# Altium schematic sheet ADC.SchDoc
size A4; DocumentNumber: 8; SheetNumber: 8; SheetTotal: 12
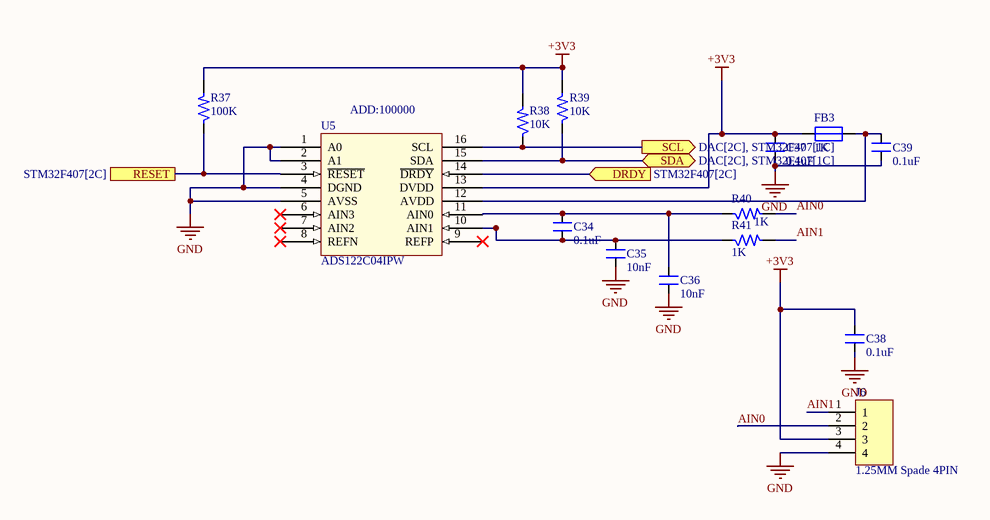
[diagram p0: ADC.SchDoc]

## Parts
C34  0.1uF  [CAP_0805]
C35  10nF  [CAP_0805]
C36  10nF  [CAP_0805]
C37  0.1uF  [CAP_0805]
C38  0.1uF  [CAP_0805]
C39  0.1uF  [CAP_0805]
FB3  1K  [IND_0805]
J6  1.25MM Spade 4PIN  [CON4_50_653004117322_TH_RA]
R37  100K  [RES_0603]
R38  10K  [RES_0603]
R39  10K  [RES_0603]
R40  1K  [RES_0603]
R41  1K  [RES_0603]
U5  ADS122C04IPW  [TSSOP16_25-59_294_54X14_SMT]

## Ports
DRDY (in, see STM32F407[2C]), RESET (see STM32F407[2C]), SCL (out, see DAC[2C], STM32F407[1C]), SDA (bidir, see DAC[2C], STM32F407[1C])

## Nets
+3V3: C37.2 C38.2 FB3.1 J6.3 R37.2 R38.2 R39.2 U5.13(DVDD)
GND: C35.1 C36.1 C37.1 C38.1 C39.1 J6.4 U5.1(A0) U5.2(A1) U5.4(DGND) U5.5(AVSS)
AIN0: J6.2 R40.2
AIN1: J6.1 R41.2
DRDY: U5.14(~{DRDY}) ; port DRDY
RESET: R37.1 U5.3(~{RESET}) ; port RESET
SCL: R38.1 U5.16(SCL) ; port SCL
SDA: R39.1 U5.15(SDA) ; port SDA
NetC34_1: C34.1 C35.2 R41.1 U5.10(AIN1)
NetC34_2: C34.2 C36.2 R40.1 U5.11(AIN0)
NetC39_2: C39.2 FB3.2 U5.12(AVDD)

Not connected (* = marked no-connect by the designer): U5 6(AIN3)* 7(AIN2)* 8(REFN)* 9(REFP)*

## Notes on the sheet
- (near U5) ADD:100000

## Library data of the parts
C34 C37-C39 = CAP_0.1uF-50V-10%-0805: 0.1µF ±10% 50V Ceramic Capacitor X7R 0805 (2012 Metric); Manufacturer: Samsung; Manufacturer Part Number: CL21B104KBCNNNC; Alternate Part Number-1: NA; Case/Package: 0805; Supplier-1: SIRICOM; Supplier Part Number-1: 0805B104K500CT
C35 C36 = CAP_10nF-50V-10%-0805: 10000pF ±10% 50V Ceramic Capacitor X7R 0805 (2012 Metric); Manufacturer: Samsung; Manufacturer Part Number: C0805C103K5RECAUTO; Alternate Part Number-1: GRM2195C1H103JA01D; Case/Package: 0805; Supplier-1: SIRICOM; Supplier Part Number-1: 0805B103K500CT
FB3 = FB_1K-100MHZ-1.6A-0805: 1 kOhms @ 100MHz 1 Power Line Ferrite Bead 0805 (2012 Metric) 1.6A; Manufacturer: Laird; Manufacturer Part Number: BLM21SP102SH1D; Alternate Part Number-1: NA; Case/Package: 0805; Supplier-1: SIRICOM; Supplier Part Number-1: ACMS201209A102
J6 = CON-PLG_4X1-50-RA-TH: 4 Pins, 1 Row 1.25mm Pitch, right angle Connector, male; Manufacturer Part Number: 653004117322; Manufacturer: JST; Mating Part Number: 653004113322; Crimp Part Number: 653153128130; Alternate Part Number-1: NA; Case/Package: TH-CON; Supplier-1: WURTH; Supplier Part Number-1: 653004117322
R37 = RES_100K-0.1W-1%-0603: 100 kOhms ±1% 0.1W, 1/10W Chip Resistor 0603 (1608 Metric) Automotive AEC-Q200 Thick Film; Manufacturer: Stackpole Electronics; Manufacturer Part Number: RMCF0603FT100K; Alternate Part Number-1: NA; Case/Package: 0603; Supplier-1: Arrow; Supplier Part Number-1: RMCF0603FT100K
R38 R39 = RES_10K-0.1W-1%-0603: 10 kOhms ±1% 0.1W, 1/10W Chip Resistor 0603 (1608 Metric) Automotive AEC-Q200 Thick Film; Manufacturer: Walsin; Manufacturer Part Number: WR06X1002FTL; Alternate Part Number-1: 0603WAJ0103T5E; Case/Package: 0603; Supplier-1: SIRICOM; Supplier Part Number-1: WR06X1002FTL
R40 R41 = RES_1K-0.1W-1%-0603: 1 kOhms ±1% 0.1W, 1/10W Chip Resistor 0603 (1608 Metric) Automotive AEC-Q200 Thick Film; Manufacturer: Walsin; Manufacturer Part Number: WR06X1001FTL; Alternate Part Number-1: 0603WAF1001T5E; Case/Package: 0603; Supplier-1: SIRICOM; Supplier Part Number-1: WR06X1001FTL
U5 = IC_ADS122C04IPW: 24 Bit Analog to Digital Converter 4 Input 1 Sigma-Delta 16-TSSOP; Manufacturer: Texas Instruments; Alternate Part Number-1: NA; Manufacturer Part Number: ADS122C04IPW; Case/Package: TSSOP16; Supplier-1: MOUSER; Supplier Part Number-1: ADS122C04IPW